# Altium schematic sheet aa8028.SCHDOC
size B
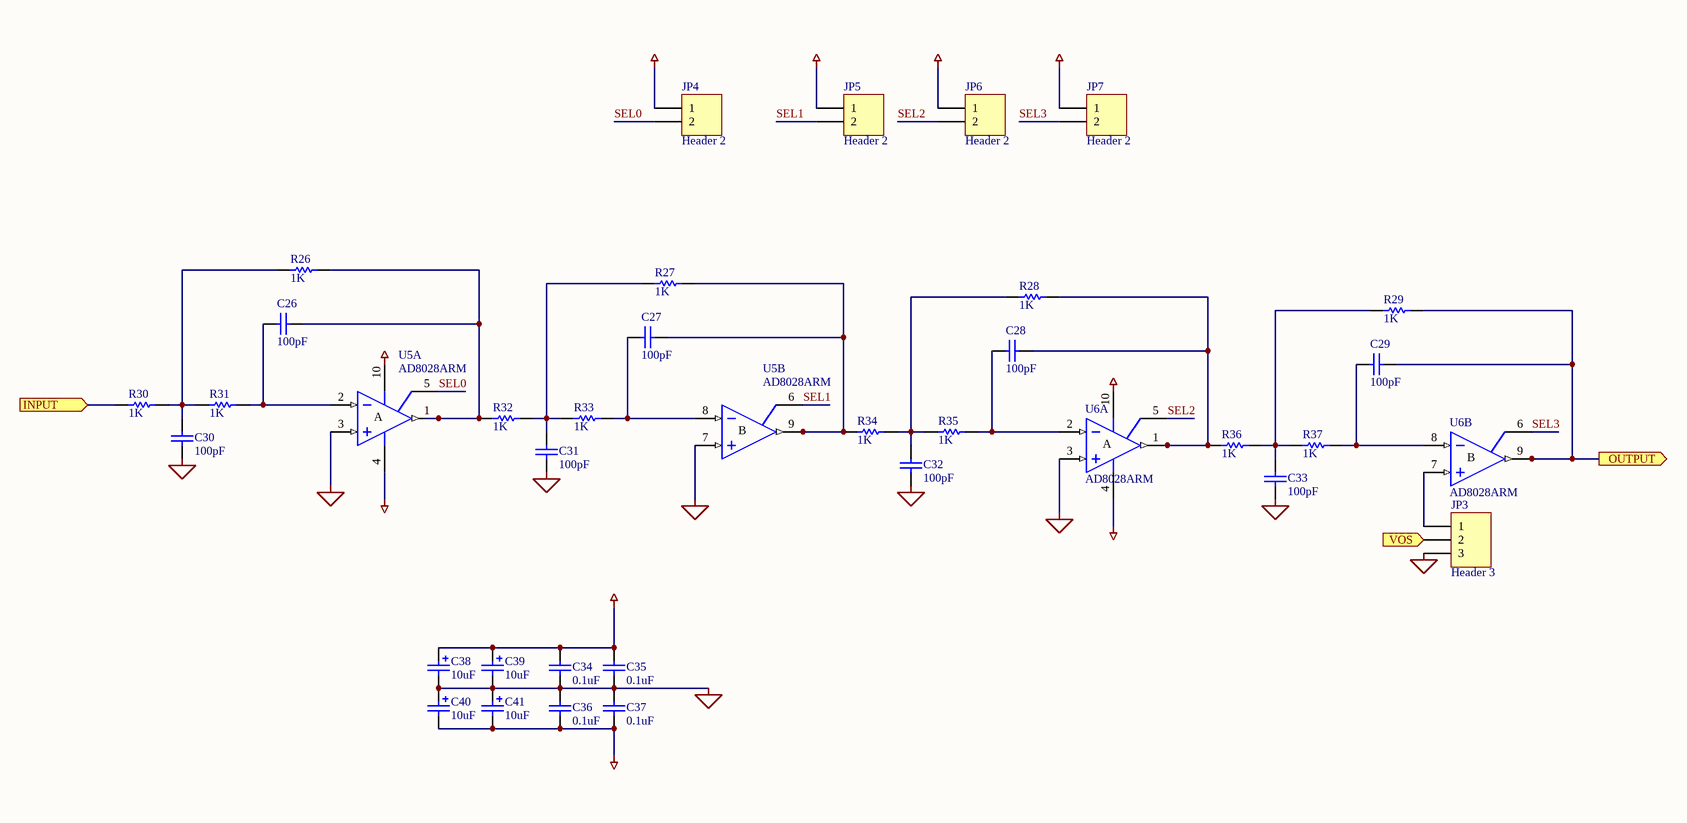
[diagram p0: aa8028.SCHDOC]

## Parts
C26  value 100pF  [CC3216-1206]  (hidden comment: Cap)
C27  value 100pF  [CC3216-1206]  (hidden comment: Cap)
C28  value 100pF  [CC3216-1206]  (hidden comment: Cap)
C29  value 100pF  [CC3216-1206]  (hidden comment: Cap)
C30  value 100pF  [CC3216-1206]  (hidden comment: Cap)
C31  value 100pF  [CC3216-1206]  (hidden comment: Cap)
C32  value 100pF  [CC3216-1206]  (hidden comment: Cap)
C33  value 100pF  [CC3216-1206]  (hidden comment: Cap)
C34  value 0.1uF  [CC1608-0603]  (hidden comment: Cap)
C35  value 0.1uF  [CC1608-0603]  (hidden comment: Cap)
C36  value 0.1uF  [CC1608-0603]  (hidden comment: Cap)
C37  value 0.1uF  [CC1608-0603]  (hidden comment: Cap)
C38  value 10uF  [TC7360-2924]  (hidden comment: Cap Pol1)
C39  value 10uF  [TC7360-2924]  (hidden comment: Cap Pol1)
C40  value 10uF  [TC7360-2924]  (hidden comment: Cap Pol1)
C41  value 10uF  [TC7360-2924]  (hidden comment: Cap Pol1)
JP3  Header 3  [HDR1X3]
JP4  Header 2  [HDR1X2]
JP5  Header 2  [HDR1X2]
JP6  Header 2  [HDR1X2]
JP7  Header 2  [HDR1X2]
R26  value 1K  [CC2012-0805]  (hidden comment: Res1)
R27  value 1K  [CC2012-0805]  (hidden comment: Res1)
R28  value 1K  [CC2012-0805]  (hidden comment: Res1)
R29  value 1K  [CC2012-0805]  (hidden comment: Res1)
R30  value 1K  [CC2012-0805]  (hidden comment: Res1)
R31  value 1K  [CC2012-0805]  (hidden comment: Res1)
R32  value 1K  [CC2012-0805]  (hidden comment: Res1)
R33  value 1K  [CC2012-0805]  (hidden comment: Res1)
R34  value 1K  [CC2012-0805]  (hidden comment: Res1)
R35  value 1K  [CC2012-0805]  (hidden comment: Res1)
R36  value 1K  [CC2012-0805]  (hidden comment: Res1)
R37  value 1K  [CC2012-0805]  (hidden comment: Res1)
U5  AD8028ARM  [TSSO3x5-G10]  (parts A,B of 2)
U6  AD8028ARM  [TSSO3x5-G10]  (parts A,B of 2)

## Ports
INPUT (in), OUTPUT (out), VOS (in)

## Nets
AVDD: C34.2 C35.2 C38.1 C39.1 JP4.1 JP5.1 JP6.1 JP7.1 U5.10(V+) U6.10(V+)
AVSS: C36.1 C37.1 C40.2 C41.2 U5.4(V-) U6.4(V-)
GND: C30.1 C31.1 C32.1 C33.1 C34.1 C35.1 C36.2 C37.2 C38.2 C39.2 C40.1 C41.1 JP3.3 U5.3(IN+A) U5.7(IN+B) U6.3(IN+A)
INPUT: R30.1 ; port INPUT
OUTPUT: C29.1 R29.1 U6.9(VOUTB) ; port OUTPUT
SEL0: JP4.2 U5.5(SELA)
SEL1: JP5.2 U5.6(SELB)
SEL2: JP6.2 U6.5(SELA)
SEL3: JP7.2 U6.6(SELB)
VOS: JP3.2 ; port VOS
NetC26_1: C26.1 R26.1 R32.1 U5.1(VOUTA)
NetC26_2: C26.2 R31.2 U5.2(IN-A)
NetC27_1: C27.1 R27.1 R34.1 U5.9(VOUTB)
NetC27_2: C27.2 R33.2 U5.8(IN-B)
NetC28_1: C28.1 R28.1 R36.1 U6.1(VOUTA)
NetC28_2: C28.2 R35.2 U6.2(IN-A)
NetC29_2: C29.2 R37.2 U6.8(IN-B)
NetC30_2: C30.2 R26.2 R30.2 R31.1
NetC31_2: C31.2 R27.2 R32.2 R33.1
NetC32_2: C32.2 R28.2 R34.2 R35.1
NetC33_2: C33.2 R29.2 R36.2 R37.1
NetJP3_1: JP3.1 U6.7(IN+B)

## Notes on the sheet
- (in symbol AD8028ARM, part A) A
- (in symbol AD8028ARM, part B) B

## Library data of the parts
C26-C37 = Cap: Capacitor; Manufacturer: Generic Components; Class I: Passive; Published: 8-Jun-2000; Revision: July-2002: Re-released for DXP Platform.; Publisher: Altium Limited; Class II: Capacitor
C38-C41 = Cap Pol1: Polarized Capacitor (Radial); Manufacturer: Generic Components; Class I: Passive; Published: 8-Jun-2000; Revision: July-2002: Re-released for DXP Platform.; Publisher: Altium Limited; Class II: Capacitor
JP3 = Header 3: Header, 3-Pin; Manufacturer: Generic Components; Class I: Connector; Revision: July-2002: Re-released for DXP Platform.; Publisher: Altium Limited
JP4-JP7 = Header 2: Header, 2-Pin; Manufacturer: Generic Components; Class I: Connector; Revision: July-2002: Re-released for DXP Platform.; Publisher: Altium Limited
R26-R37 = Res1: Resistor; Manufacturer: Generic Components; Class I: Passive; Published: 8-Jun-2000; Revision: July-2002: Re-released for DXP Platform.; Publisher: Altium Limited; Class II: Resistor
U5 U6 = AD8028ARM: Analog Devices Low Distortion, High Speed RRIO OA